# Altium schematic sheet V2.0.SchDoc
size 127 x 86 mm
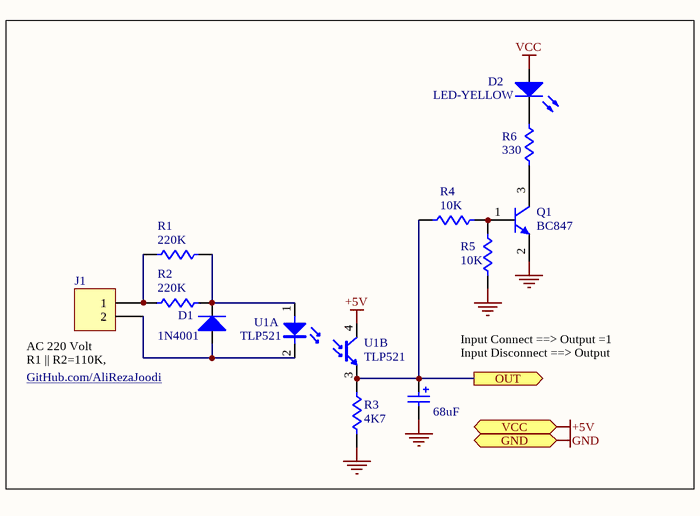
[diagram p0: V2.0.SchDoc]

## Parts
C1  value 68uF  [Cap_D]  (hidden comment: CAP)
D1  1N4001  [MELF-D3516-1406]
D2  LED-YELLOW  [0805_Diode]
J1  J9  [Fonics_2PIN_1]  (value not drawn)
Q1  BC847  [SOT23-3N]
R1  value 220K  [0805]  (hidden comment: RES)
R2  value 220K  [0805]  (hidden comment: RES)
R3  4K7  [0805]
R4  10K  [0805]
R5  10K  [0805]
R6  330  [0805]
U1  TLP521  [SMD_4PIN]  (parts A,B of 2)

## Ports
GND (in), OUT (out), VCC (in)

## Nets
+5V: U1.4(C) ; port VCC
GND: C1.2 Q1.2(E) R3.2 R5.1 ; port GND
VCC: D2.1(A)
OUT: C1.1 R3.1 R4.1 U1.3(E) ; port OUT
NetD1_1: D1.1(A) J1.2 U1.2(K)
NetD1_2: D1.2(K) R1.2 R2.2 U1.1(A)
NetD2_2: D2.2(K) R6.1
NetJ1_1: J1.1 R1.1 R2.1
NetQ1_1: Q1.1(B) R4.2 R5.2
NetQ1_3: Q1.3(C) R6.2

## Notes on the sheet
- (near J1) AC 220 Volt
  R1 || R2=110K, 0.5W
- GitHub.com/AliRezaJoodi
- Input Connect ==> Output =1
  Input Disconnect ==> Output =0

## Library data of the parts
C1 = Cap Pol1: Polarized Capacitor (Radial); Manufacturer: Generic Components; Class I: Passive; Published: 8-Jun-2000; Revision: July-2002: Re-released for DXP Platform.; Publisher: Altium Limited; Class II: Capacitor
D1 = Diode: Default Diode; Manufacturer: Generic Components; Class I: Discrete; Class II: Diode - Switching; Published: 8-Jun-2000; Revision: July-2002: Re-released for DXP Platform.; Publisher: Altium Limited; Value: 1N4001
D2 = LED: Typical INFRARED GaAs LED; Manufacturer: Generic Components; Class I: Optoelectronic; Published: 8-Jun-2000; Revision: July-2002: Re-released for DXP Platform.; Publisher: Altium Limited; Class II: LED
J1 = Header 2: Header, 2-Pin; LatestRevisionDate: 17-Jul-2002; LatestRevisionNote: Re-released for DXP Platform.; Publisher: Altium Limited
Q1 = BC847: Silicon Bipolar Transistor
R1-R6 = Res1: Resistor; Manufacturer: Generic Components; Class I: Passive; Published: 8-Jun-2000; Revision: July-2002: Re-released for DXP Platform.; Publisher: Altium Limited; Class II: Resistor
U1 = Optoisolator: Publisher: Altium Limited